# EAGLE design lin_master_node (EAGLE 6.5.0)
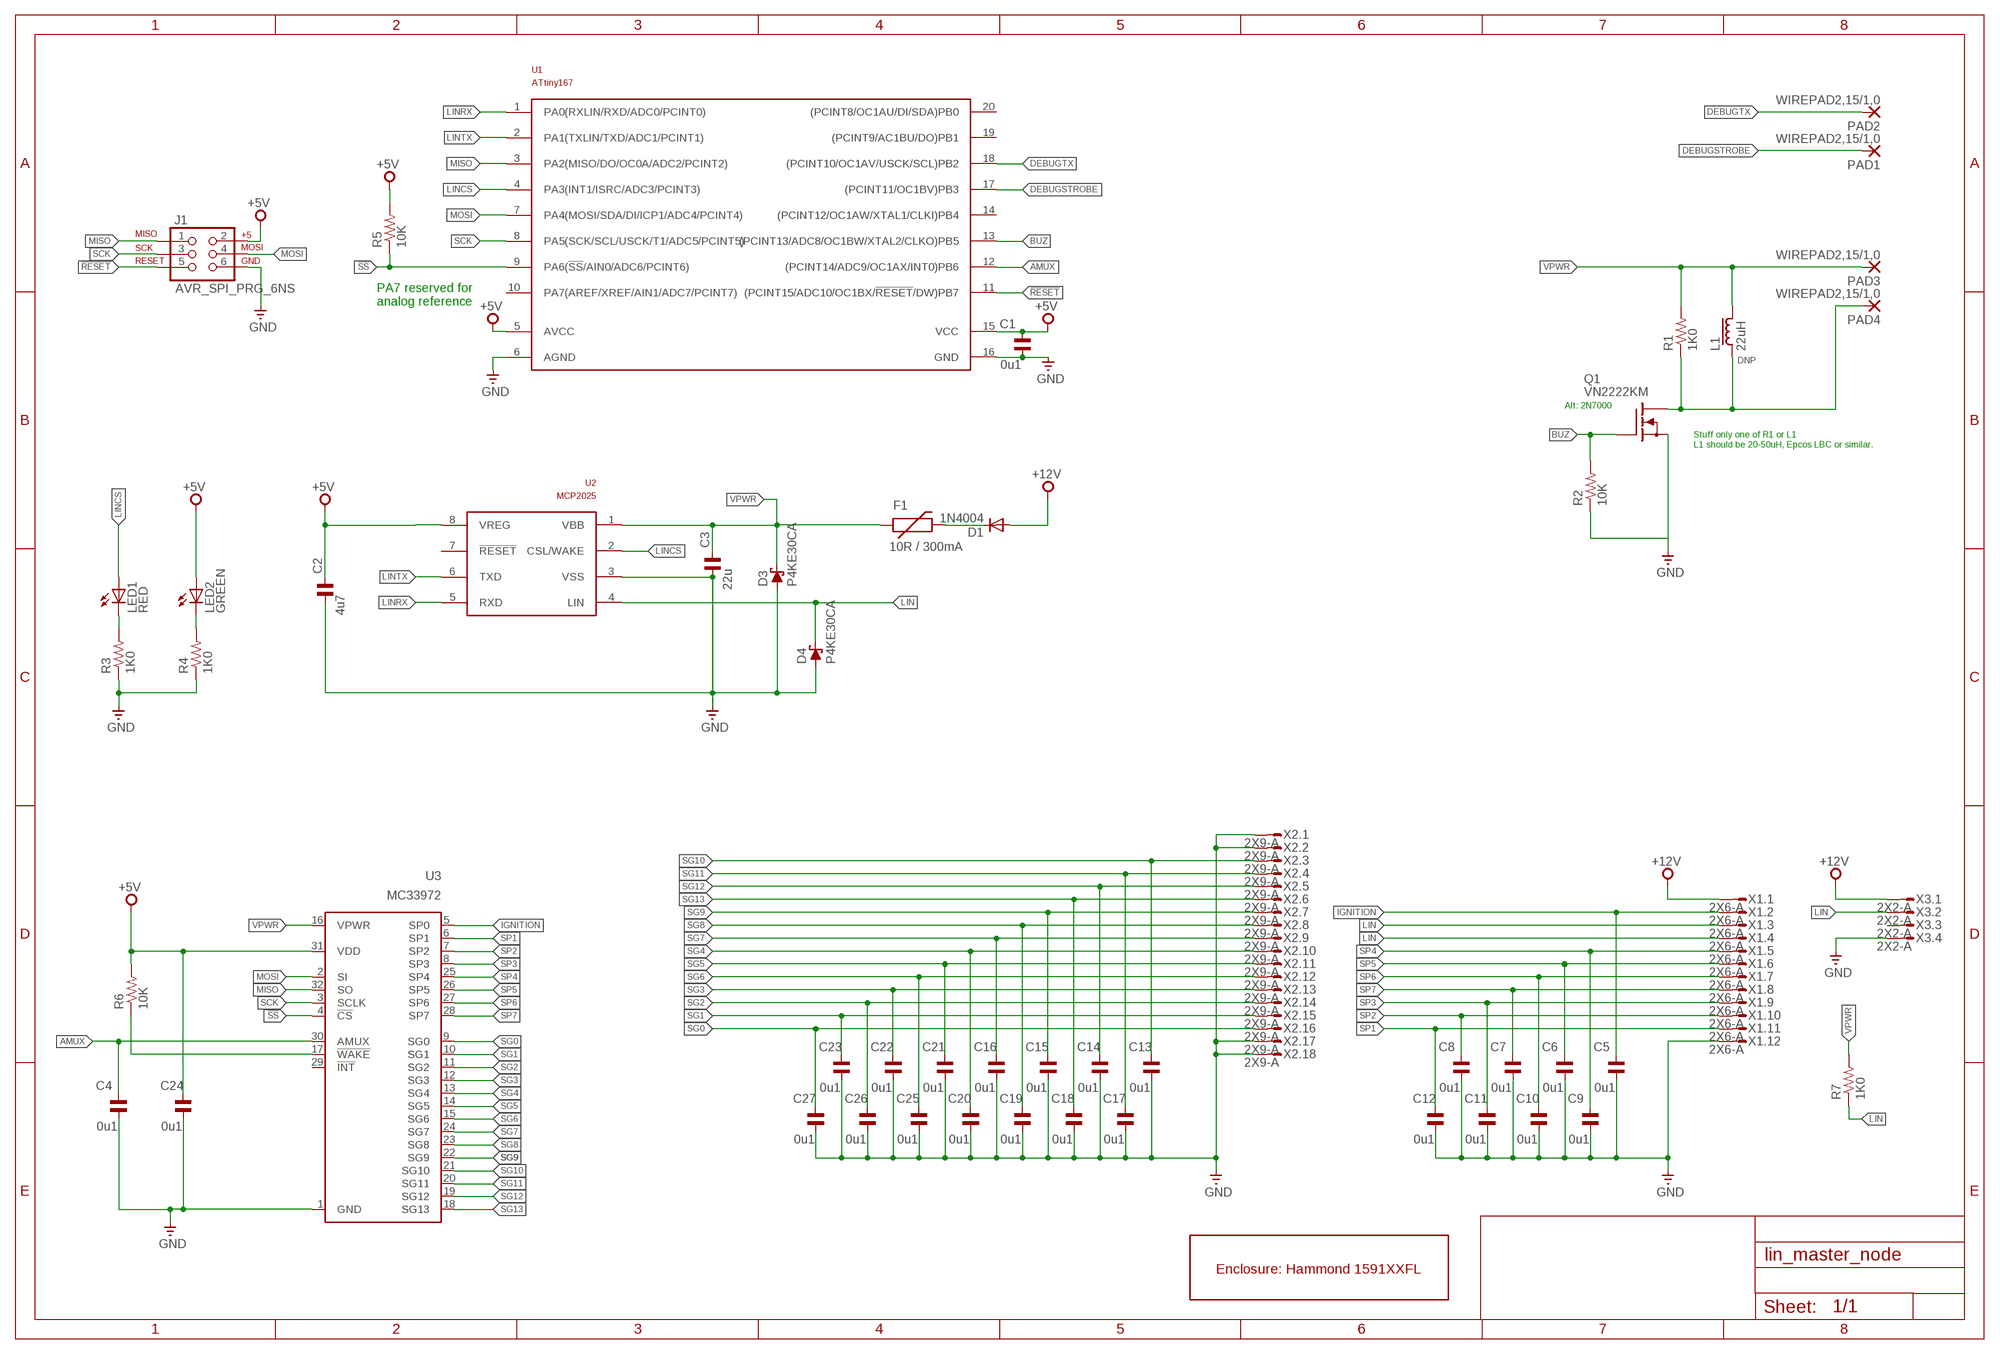
[diagram p0: schematic, sheet 1]

## Parts
C1  0u1  C-EU050-024X044  [C050-024X044]
C2  4u7  C-EU050-024X044  [C050-024X044]
C3  22u  C-EU050-024X044  [C050-024X044]
C4  0u1  C-EU050-024X044  [C050-024X044]
C5  0u1  C-EUC0805K  [C0805K]
C6  0u1  C-EUC0805K  [C0805K]
C7  0u1  C-EUC0805K  [C0805K]
C8  0u1  C-EUC0805K  [C0805K]
C9  0u1  C-EUC0805K  [C0805K]
C10  0u1  C-EUC0805K  [C0805K]
C11  0u1  C-EUC0805K  [C0805K]
C12  0u1  C-EUC0805K  [C0805K]
C13  0u1  C-EUC0805K  [C0805K]
C14  0u1  C-EUC0805K  [C0805K]
C15  0u1  C-EUC0805K  [C0805K]
C16  0u1  C-EUC0805K  [C0805K]
C17  0u1  C-EUC0805K  [C0805K]
C18  0u1  C-EUC0805K  [C0805K]
C19  0u1  C-EUC0805K  [C0805K]
C20  0u1  C-EUC0805K  [C0805K]
C21  0u1  C-EUC0805K  [C0805K]
C22  0u1  C-EUC0805K  [C0805K]
C23  0u1  C-EUC0805K  [C0805K]
C24  0u1  C-EU050-024X044  [C050-024X044]
C25  0u1  C-EUC0805K  [C0805K]
C26  0u1  C-EUC0805K  [C0805K]
C27  0u1  C-EUC0805K  [C0805K]
D1  1N4004  [DO41-10]
D3  P4KE30CA  P4KEXX  [DO41-10]
D4  P4KE30CA  P4KEXX  [DO41-10]
F1  10R / 300mA  PTCPTH  [PTC]
J1  AVR_SPI_PRG_6NS  [2X3-NS]
L1  22uH  LBC15A  [LBC15A]
LED1  RED  LED3MM  [LED3MM]
LED2  GREEN  LED3MM  [LED3MM]
PAD1  WIREPAD2,15/1,0  [2,15/1,0]
PAD2  WIREPAD2,15/1,0  [2,15/1,0]
PAD3  WIREPAD2,15/1,0  [2,15/1,0]
PAD4  WIREPAD2,15/1,0  [2,15/1,0]
Q1  VN2222KM  [TO237]
R1  1K0  R-EU_0207/10  [0207/10]
R2  10K  R-EU_0207/10  [0207/10]
R3  1K0  R-EU_0207/10  [0207/10]
R4  1K0  R-EU_0207/10  [0207/10]
R5  10K  R-EU_0207/10  [0207/10]
R6  10K  R-EU_0207/10  [0207/10]
R7  1K0  R-EU_0207/10  [0207/10]
U1  ATtiny167  ATTINY167  [SO20W]
U2  MCP2025  [SO08]
U3  MC33972  [SOIC32W]
U$1  1591XXAFL  [1591XXAFL]
X1  2X6-A  [4-794618-2]
X2  2X9-A  [4-794618-8]
X3  2X2-A  [3-794618-4]

## Nets
!RESET: J1.5 U1.11((PCINT15/ADC10/OC1BX/!RESET!/DW)PB7)
!SS: R5.1 U1.9(PA6(!SS!/AIN0/ADC6/PCINT6)) U3.4(!CS)
+5V [power]: C1.1 C2.1 C24.1 J1.2 LED2.A R5.2 R6.2 U1.5(AVCC) U1.15(VCC) U2.8(VREG) U3.31(VDD)
+12V [power]: D1.A X1.1 X3.1
AMUX: C4.1 U1.12((PCINT14/ADC9/OC1AX/INT0)PB6) U3.30(AMUX)
BUZ: Q1.2(G) R2.2 U1.13((PCINT13/ADC8/OC1BW/XTAL2/CLKO)PB5)
DEBUGSTROBE: PAD1.1(P) U1.17((PCINT11/OC1BV)PB3)
DEBUGTX: PAD2.1(P) U1.18((PCINT10/OC1AV/USCK/SCL)PB2)
GND [power]: C1.2 C2.2 C3.2 C4.2 C5.2 C6.2 C7.2 C8.2 C9.2 C10.2 C11.2 C12.2 C13.2 C14.2 C15.2 C16.2 C17.2 C18.2 C19.2 C20.2 C21.2 C22.2 C23.2 C24.2 C25.2 C26.2 C27.2 D3.A D4.A J1.6 Q1.3(S) R2.1 R3.1 R4.1 U1.6(AGND) U1.16(GND) U2.3(VSS) U3.1(GND) X1.12 X2.1 X2.2 X2.17 X2.18 X3.4
IGNITION: C5.1 U3.5(SP0) X1.2
LIN: D4.C R7.1 U2.4(LIN) X1.3 X1.4 X3.2
LINCS: LED1.A U1.4(PA3(INT1/ISRC/ADC3/PCINT3)) U2.2(CSL/WAKE)
LINRX: U1.1(PA0(RXLIN/RXD/ADC0/PCINT0)) U2.5(RXD)
LINTX: U1.2(PA1(TXLIN/TXD/ADC1/PCINT1)) U2.6(TXD)
MISO: J1.1 U1.3(PA2(MISO/DO/OC0A/ADC2/PCINT2)) U3.32(SO)
MOSI: J1.4 U1.7(PA4(MOSI/SDA/DI/ICP1/ADC4/PCINT4)) U3.2(SI)
N$1: LED1.K(C) R3.2
N$2: R6.1 U3.17(!WAKE)
N$3: L1.1 PAD4.1(P) Q1.1(D) R1.1
N$4: LED2.K(C) R4.2
N$5 [power]: D1.C F1.P$2
SCK: J1.3 U1.8(PA5(SCK/SCL/USCK/T1/ADC5/PCINT5)) U3.3(SCLK)
SG0: C27.1 U3.9(SG0) X2.16
SG1: C23.1 U3.10(SG1) X2.15
SG2: C26.1 U3.11(SG2) X2.14
SG3: C22.1 U3.12(SG3) X2.13
SG4: C20.1 U3.13(SG4) X2.10
SG5: C21.1 U3.14(SG5) X2.11
SG6: C25.1 U3.15(SG6) X2.12
SG7: C16.1 U3.24(SG7) X2.9
SG8: C19.1 U3.23(SG8) X2.8
SG9: C15.1 U3.22(SG9) X2.7
SG10: C13.1 U3.21(SG10) X2.3
SG11: C17.1 U3.20(SG11) X2.4
SG12: C14.1 U3.19(SG12) X2.5
SG13: C18.1 U3.18(SG13) X2.6
SP1: C12.1 U3.6(SP1) X1.11
SP2: C8.1 U3.7(SP2) X1.10
SP3: C11.1 U3.8(SP3) X1.9
SP4: C9.1 U3.25(SP4) X1.5
SP5: C6.1 U3.26(SP5) X1.6
SP6: C10.1 U3.27(SP6) X1.7
SP7: C7.1 U3.28(SP7) X1.8
VPWR [power]: C3.1 D3.C F1.P$1 L1.2 PAD3.1(P) R1.2 R7.2 U2.1(VBB) U3.16(VPWR)
Unconnected: U1.10(PA7(AREF/XREF/AIN1/ADC7/PCINT7)) U1.14((PCINT12/OC1AW/XTAL1/CLKI)PB4) U1.19((PCINT9/AC1BU/DO)PB1) U1.20((PCINT8/OC1AU/DI/SDA)PB0) U2.7(!RESET) U3.29(!INT) X3.3

## Notes on the sheet
- PA7 reserved for
  analog reference
- Alt: 2N7000
- Stuff only one of R1 or L1
  L1 should be 20-50uH, Epcos LBC or similar.

## Library data of the parts
C1 C4 C24 = custom:C-EU: CAPACITOR, European symbol; PARTNO: FK28X7R1H104K
C2 = custom:C-EU: CAPACITOR, European symbol; PARTNO: FK28X5R0J475K
C3 = custom:C-EU: CAPACITOR, European symbol; PARTNO: FK22X5R1E226M
C5-C23 C25-C27 = custom:C-EU: CAPACITOR, European symbol; PARTNO: C2012X7R1H104K085AA
D1 = custom:1N4004: DIODE general purpose rectifier, 1 A; PARTNO: 1N4004-TP
D3 D4 = custom:P4KEXX: DIODE transient-voltage suppressor; PARTNO: P4KE30CA
F1 = custom:PTC: Resettable Fuse PTC Resettable Fuse. Spark Fun Electronics SKU : COM-08357; PARTNO: CMF-RL10-0
J1 = custom:AVR_SPI_PRG_6: AVR ISP 6 Pin This is the reduced ISP connector for AVR programming. Common on Arduino. This footprint will take up less PCB space and can be used with a 10-pin to 6-pin adapter such as SKU: BOB-08508
L1 = custom:LBC15A: INDUCTOR; DNP: YES
LED1 = custom:LED: LEDs Standard schematic elements and footprints for 5mm, 3mm, 1206, and 0603 sized LEDs. 5mm - Spark Fun Electronics SKU : COM-00529 (and others); PARTNO: C4SMF-RJS-CT0W0BB2
LED2 = custom:LED: LEDs Standard schematic elements and footprints for 5mm, 3mm, 1206, and 0603 sized LEDs. 5mm - Spark Fun Electronics SKU : COM-00529 (and others); PARTNO: C4SMF-GJS-CV0Y0792
PAD1-PAD4 = custom:WIREPAD: Wire PAD connect wire on PCB
Q1 = custom:VN2222KM: N-Channel Enhancement MOSFET (VMOS); 60V; 0,5A; 7,5Ohm
R1 R3 R4 R7 = custom:R-EU_: RESISTOR, European symbol; PARTNO: CF14JT1K00
R2 R5 R6 = custom:R-EU_: RESISTOR, European symbol; PARTNO: CF14JT10K0
U1 = custom:ATTINY167; PARTNO: ATTINY167-SU
U2 = custom:MCP2025: LIN Transceiver with Voltage Regulator; PARTNO: MCP2025-500E/SN
U3 = custom:MC33972: edit this description Auto generated by make-symbol-device-package-bsdl.ulp Rev. 43 Source:; PARTNO: MC33972ATEW
U$1 = custom:1591XXAFL; PARTNO: 1591XXAFLBK
X1 = custom:2X6; PARTNO: 4-794618-2
X2 = custom:2X9; PARTNO: 4-794618-8
X3 = custom:2X2; PARTNO: 3-794618-4

## Net classes
0 default: width 0.381 mm
1 power: width 0.635 mm

## Board
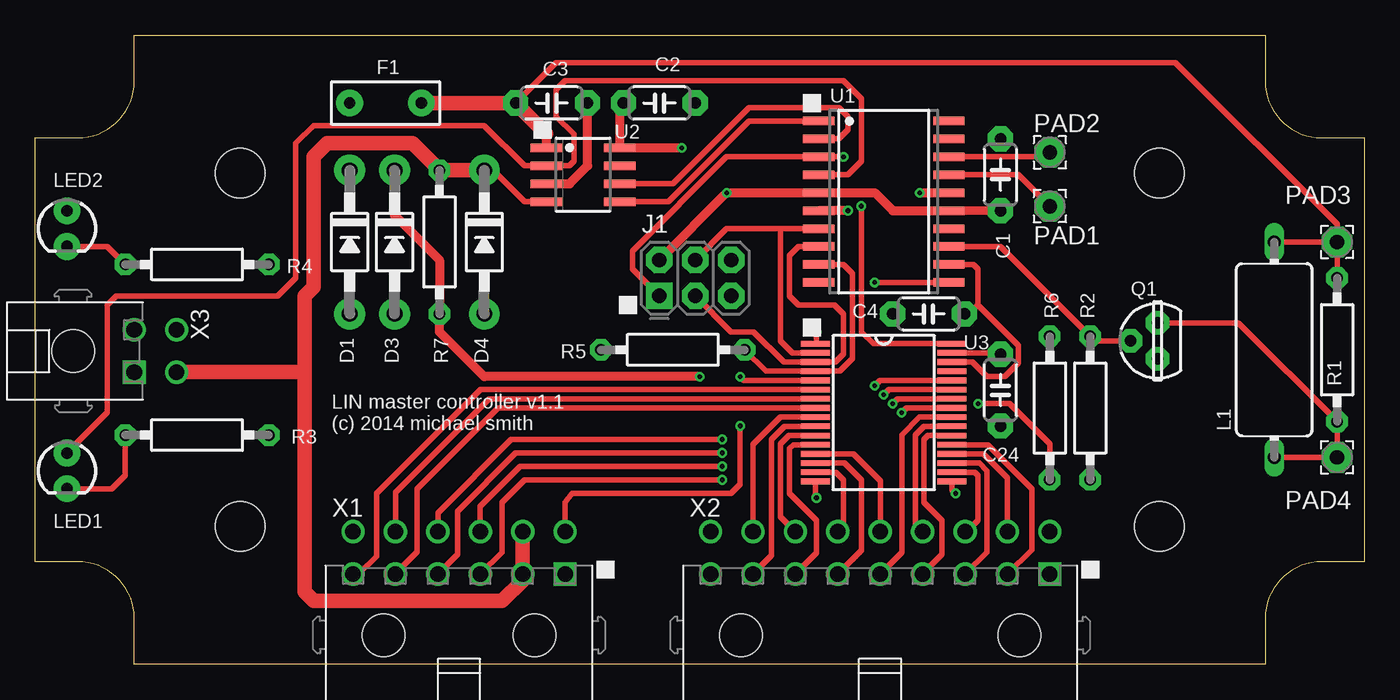
[diagram p1: board, top side]
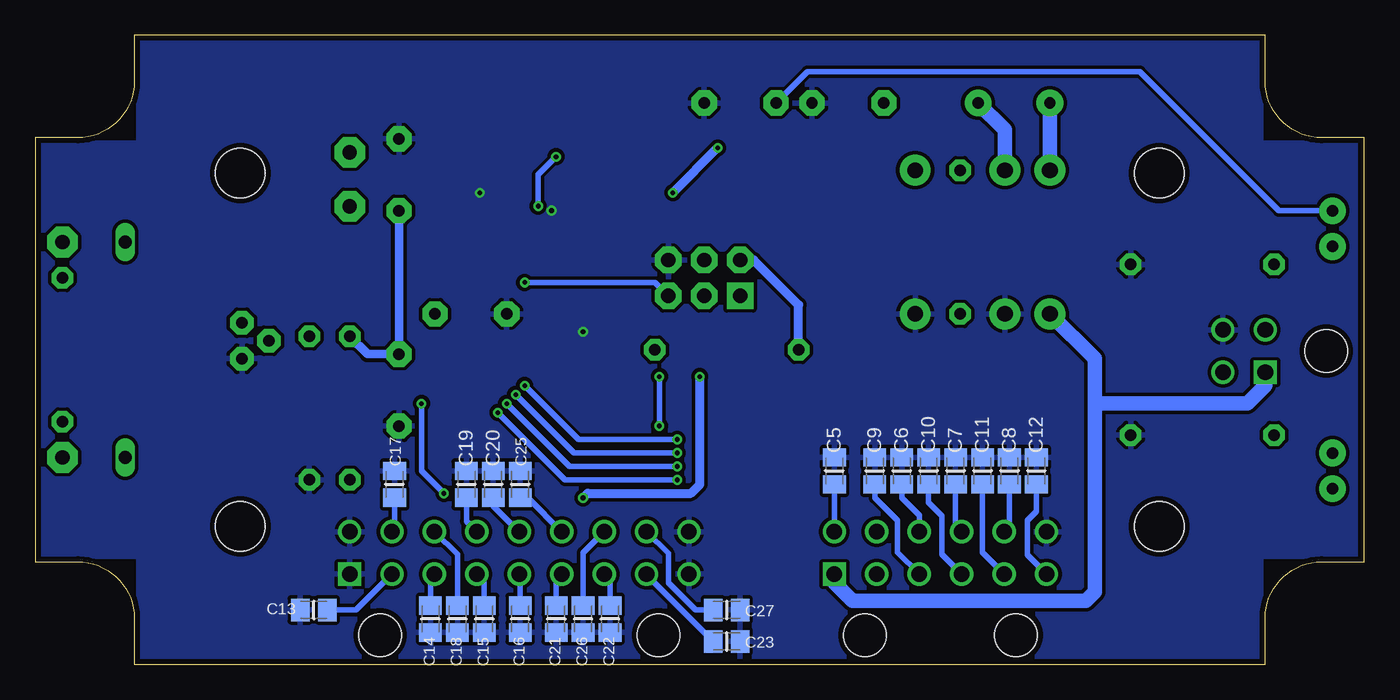
[diagram p2: board, bottom side, seen from below]

Size 94 x 44.5 mm. Coordinates in mm from the lower left corner, seen from the top.
Copper layers (1*16): Top 0.0356mm / dielectric 1.5011mm / Bottom 0.0356mm
Design rules "LaenPCBOrder": minimum track width 6mil, minimum drill 13mil, track to track 6mil, track to pad 6mil, pad to pad 6mil, via to via 6mil, smd to smd 6mil, copper to edge 15mil, drill to drill 6mil, minimum pad ring 7mil, minimum via ring 7mil, stop-mask expansion 3mil, vias tented up to drill 0mil, thermal gap 10mil

### Footprints (pad centres in the part's own frame; a part is rotated, then mirrored left to right if it is on the bottom)
C050-024X044 = drill 0.813 pad 1.778 octagon: 1 -2.54,0; 2 2.54,0
C0805K = smd 1.3 x 1.6: 1 -0.953,0; 2 0.953,0
DO41-10 = drill 1.118 pad 2.184: A 5.08,0; C -5.08,0
PTC = drill 0.8 pad 1.88: P$1 -2.54,0; P$2 2.54,0
2X3-NS = drill 1.016 pad 1.88 square: 1 -2.54,-1.27 | drill 1.016 pad 1.88 octagon: 2 -2.54,1.27; 3 0,-1.27; 4 0,1.27; 5 2.54,-1.27; 6 2.54,1.27
LBC15A = drill 0.914 long: 1 -7.62,0; 2 7.62,0
LED3MM = drill 0.813 pad 1.88: A -1.27,0; K 1.27,0
2,15/1,0 = drill 1.016 pad 2.159 octagon: 1 0,0
TO237 = drill 0.813 pad 1.676 octagon: 1 1.27,0; 2 0,1.905; 3 -1.27,0
0207/10 = drill 0.813 pad 1.524 octagon: 1 -5.08,0; 2 5.08,0
SO20W = smd 0.6 x 2.2: 1 -5.715,-4.6; 2 -4.445,-4.6; 3 -3.175,-4.6; 4 -1.905,-4.6; 5 -0.635,-4.6; 6 0.635,-4.6; 7 1.905,-4.6; 8 3.175,-4.6; 9 4.445,-4.6; 10 5.715,-4.6; 11 5.715,4.6; 12 4.445,4.6; 13 3.175,4.6; 14 1.905,4.6; 15 0.635,4.6; 16 -0.635,4.6; 17 -1.905,4.6; 18 -3.175,4.6; 19 -4.445,4.6; 20 -5.715,4.6
SO08 = smd 0.6 x 2.2: 1 -1.905,-2.6; 2 -0.635,-2.6; 3 0.635,-2.6; 4 1.905,-2.6; 5 1.905,2.6; 6 0.635,2.6; 7 -0.635,2.6; 8 -1.905,2.6
SOIC32W = smd 2.05 x 0.4: 1 -4.825,4.875; 2 -4.825,4.225; 3 -4.825,3.575; 4 -4.825,2.925; 5 -4.825,2.275; 6 -4.825,1.625; 7 -4.825,0.975; 8 -4.825,0.325; 9 -4.825,-0.325; 10 -4.825,-0.975; 11 -4.825,-1.625; 12 -4.825,-2.275; 13 -4.825,-2.925; 14 -4.825,-3.575; 15 -4.825,-4.225; 16 -4.825,-4.875; 17 4.825,-4.875; 18 4.825,-4.225; 19 4.825,-3.575; 20 4.825,-2.925; 21 4.825,-2.275; 22 4.825,-1.625; 23 4.825,-0.975; 24 4.825,-0.325; 25 4.825,0.325; 26 4.825,0.975; 27 4.825,1.625; 28 4.825,2.275; 29 4.825,2.925; 30 4.825,3.575; 31 4.825,4.225; 32 4.825,4.875
1591XXAFL = hole 3.5: -32.5,12.5; 32.5,12.5; -32.5,-12.5; 32.5,-12.5
4-794618-2 = drill 1.1 square: 1 0,0 | drill 1.1: 2 0,3; 3 -3,0; 4 -3,3; 5 -6,0; 6 -6,3; 7 -9,0; 8 -9,3; 9 -12,0; 10 -12,3; 11 -15,0; 12 -15,3 | hole 3: -2.15,-4.32; -12.85,-4.32
4-794618-8 = drill 1.1 square: 1 0,0 | drill 1.1: 2 0,3; 3 -3,0; 4 -3,3; 5 -6,0; 6 -6,3; 7 -9,0; 8 -9,3; 9 -12,0; 10 -12,3; 11 -15,0; 12 -15,3; 13 -18,0; 14 -18,3; 15 -21,0; 16 -21,3; 17 -24,0; 18 -24,3 | hole 3: -2.15,-4.32; -21.85,-4.32
3-794618-4 = drill 1.1 square: 1 0,0 | drill 1.1: 2 0,3; 3 -3,0; 4 -3,3 | hole 3: -1.5,-4.32

### Placement (x,y rotation side)
C1  68.27,34.63 90 top
C2  44.14,39.71 0 top
C3  36.52,39.71 0 top
C4  63.19,24.79 180 top
C5  37.48,13.68 90 bottom
C6  32.71,13.68 90 bottom
C7  28.9,13.68 90 bottom
C8  25.09,13.68 90 bottom
C9  34.62,13.68 90 bottom
C10  30.81,13.68 90 bottom
C11  27,13.68 90 bottom
C12  23.19,13.68 90 bottom
C13  74.31,3.84 180 bottom
C14  66.05,3.2 270 bottom
C15  62.24,3.2 270 bottom
C16  59.7,3.2 270 bottom
C17  68.59,12.73 90 bottom
C18  64.15,3.2 270 bottom
C19  63.51,12.73 90 bottom
C20  61.6,12.73 90 bottom
C21  57.16,3.2 270 bottom
C22  53.35,3.2 270 bottom
C23  45.09,1.61 0 bottom
C24  68.27,19.39 270 top
C25  59.7,12.73 90 bottom
C26  55.25,3.2 270 bottom
C27  45.09,3.84 0 bottom
D1  22.23,29.87 270 top
D3  25.41,29.87 270 top
D4  31.76,29.87 270 top
F1  24.77,39.71 180 top
J1  46.68,27.33 0 top
L1  87.64,22.25 90 top
LED1  2.23,13.68 270 top
LED2  2.23,30.82 270 top
PAD1  71.76,32.41 0 top
PAD2  71.76,36.22 0 top
PAD3  92.09,29.87 0 top
PAD4  92.09,14.63 0 top
Q1  79.38,22.89 90 top
R1  92.09,22.25 90 top
R2  74.62,18.12 90 top
R3  11.44,16.22 180 top
R4  11.44,28.28 180 top
R5  45.09,22.25 180 top
R6  71.76,18.12 90 top
R7  28.58,29.87 270 top
U1  60.02,32.73 270 top
U2  38.74,34.63 270 top
U3  60.02,17.8 0 top
U$1  47,22.25 0 top
X1  37.48,6.38 0 top
X2  71.76,6.38 0 top
X3  6.99,20.66 270 top

### Tracks (layer width: path | path; a pad name or v marks a point on that pad's centre or on a via)
!RESET  (via drill 0.33)
  Top 0.381: U1.11 v59.38,27.01
  Bottom 0.381: v59.38,27.01 50.17,27.01 J1.5
!SS
  Top 0.381: R5.1 51.7,20.73 U3.4 56.91,20.73 57.79,21.62 57.79,27.65 57.16,28.28 U1.9
+5V  (via drill 0.33)
  Top 0.381: U3.31 68.18,22.03 C24.1
  Top 0.61: U1.15 C1.1
  Top 0.635: C2.1 41.34,39.45 U2.8 v45.73,36.54 | J1.2 v48.91,33.36 U1.5 59.38,33.36 60.65,32.09 U1.15
  Bottom 0.381: C2.1 39.38,41.94 15.88,41.94 6.04,32.09 LED2.A
  Bottom 0.61: C1.1 C24.1 70.5,21.93 R6.2
  Bottom 0.635: R5.2 40.02,25.43 43.19,28.6 J1.2 | v45.73,36.54 v48.91,33.36
+12V
  Bottom 1.016: X1.1 37.48,5.74 36.2,4.47 19.69,4.47 19.06,5.11 19.06,18.44 | 19.06,18.44 19.06,21.62 D1.A | X3.1 6.99,19.71 8.26,18.44 19.06,18.44
AMUX
  Top 0.381: U3.30 66.28,21.38 67.32,20.34 68.59,20.34 69.54,21.3 69.54,22.57 66.69,25.43 | U1.12 66.37,28.28 66.69,27.96 66.69,25.43 | C4.1 66.05,24.79 66.69,25.43
BUZ
  Top 0.381: U1.13 68.27,29.55 R2.2 74.94,22.89 Q1.2
DEBUGSTROBE
  Top 0.381: U1.17 69.54,34.63 PAD1.1
DEBUGTX
  Top 0.381: U1.18 71.45,35.9 PAD2.1
GND  (via drill 0.33)
  Top 0.381: U3.1 55.25,22.74 v55.25,23.52
  Top 0.635: v62.56,33.36 U1.16 | v57.48,32.09 U1.6 | U2.3 37.79,34 39.06,35.27 C3.2
  pour Bottom (isolate 0.254): 0.64,7.65 0.64,36.86 7.31,36.86 7.31,44.16 86.69,44.16 86.69,36.86 93.67,36.86 93.67,7.65 86.69,7.65 86.69,0.34 7.31,0.34 7.31,7.65
IGNITION  (via drill 0.33)
  Top 0.381: v49.86,16.85 49.86,12.73 49.22,12.09 37.97,12.09 37.48,11.46 X1.2 | v49.86,20.34 50.12,20.08 U3.5
  Bottom 0.381: C5.1 X1.2 | v49.86,16.85 v49.86,20.34
LIN
  Top 0.381: D4.C 32.39,34.95 34.62,32.73 U2.4
  Top 1.016: 19.06,20.66 19.06,26.06 19.69,26.7 19.69,35.9 20.65,36.86 26.68,36.86 R7.1 D4.C | 19.06,20.66 19.06,5.11 19.69,4.47 33.03,4.47 34.48,5.92 X1.3 X1.4 | X3.2 19.06,20.66
LINCS
  Top 0.381: LED1.A 5.09,17.8 5.09,25.43 5.72,26.06 17.15,26.06 18.42,27.33 18.42,36.86 19.69,38.12 31.76,38.12 34.62,35.27 U2.2 37.79,35.27 38.11,35.59 38.11,37.49 36.84,38.76 36.84,40.66 37.48,41.3 57.16,41.3 58.43,40.03 58.43,35.59 57.48,34.63 U1.4
LINRX
  Top 0.381: U2.5 44.78,32.73 50.49,38.44 U1.1
LINTX
  Top 0.381: U2.6 45.09,34 50.49,39.4 56.84,39.4 57.48,38.76 57.48,37.81 56.84,37.17 U1.2
MISO  (via drill 0.33)
  Top 0.381: J1.1 42.24,27.96 42.24,29.23 48.91,35.9 U1.3 v57.16,35.9 | U3.32 59.27,22.68 58.43,23.52 v58.43,32.41
  Bottom 0.381: v58.43,32.41 58.43,34.63 v57.16,35.9
MOSI
  Top 0.381: J1.4 48.91,30.82 52.71,30.82 | 52.71,30.82 U1.7 | U3.2 53.57,22.03 52.71,22.89 52.71,30.82
N$1
  Top 0.381: LED1.K 5.41,12.41 6.36,13.36 R3.2
N$2  (via drill 0.33)
  Top 0.381: U3.17 64.84,12.35 v65.1,12.09
  Top 0.406: v66.69,18.44 68.91,18.44 71.76,15.58 R6.1
  Bottom 0.406: v65.1,12.09 66.69,13.68 v66.69,18.44
N$3
  Top 0.381: Q1.1 85.1,24.16 R1.1 PAD4.1 L1.1
N$4
  Top 0.381: LED2.K 5.09,29.55 R4.2
N$5
  Bottom 1.016: D1.C F1.P$2
SCK
  Top 0.381: U1.8 53.98,29.55 53.35,28.92 53.35,26.06 53.98,25.43 56.52,25.43 57.16,24.79 57.16,21.93 56.61,21.38 U3.3 52.95,21.38 50.81,23.52 49.22,23.52 J1.3
SG0
  Top 0.381: X2.16 50.77,15.54 52.71,17.48 U3.9
  Bottom 0.406: X2.16 49.22,7.83 49.22,5.74 47.32,3.84 C27.1
SG1
  Top 0.381: X2.15 52.08,7.69 52.08,15.9 53.01,16.83 U3.10
  Bottom 0.406: C23.1 50.77,6.33 X2.15
SG2
  Top 0.381: X2.14 52.71,10.43 52.71,15.58 53.31,16.18 U3.11
  Bottom 0.406: X2.14 55.25,7.88 C26.1
SG3
  Top 0.381: U3.12 53.61,15.53 53.35,15.27 53.35,12.09 55.25,10.19 55.25,7.87 X2.13
  Bottom 0.406: X2.13 53.35,5.96 C22.1
SG4
  Top 0.381: X2.10 59.77,12.98 57.86,14.88 U3.13
  Bottom 0.406: C20.1 61.6,11.21 X2.10
SG5
  Top 0.381: X2.11 58.43,8.04 58.43,13.04 57.24,14.23 U3.14
  Bottom 0.406: X2.11 57.16,5.98 C21.1
SG6
  Top 0.381: X2.12 56.77,9.47 57.16,9.87 57.16,13.04 56.62,13.58 U3.15
  Bottom 0.406: C25.1 59.16,11.77 X2.12
SG7
  Top 0.381: X2.9 61.29,7.9 61.29,16.22 62.55,17.48 U3.24
  Bottom 0.406: X2.9 59.7,6.31 C16.1
SG8
  Top 0.381: X2.8 62.77,9.34 62.24,9.87 62.24,16.22 62.85,16.83 U3.23
  Bottom 0.406: C19.1 63.51,10.12 X2.8
SG9
  Top 0.381: X2.7 64.15,7.76 64.15,10.19 62.88,11.46 62.88,15.9 63.16,16.18 U3.22
  Bottom 0.406: X2.7 62.24,5.85 C15.1
SG10
  Top 0.381: X2.3 70.5,8.11 70.5,12.41 67.37,15.53 U3.21
  Bottom 0.406: C13.1 71.31,3.84 X2.3
SG11
  Top 0.381: X2.4 68.76,13.19 67.07,14.88 U3.20
  Bottom 0.406: C17.1 68.59,9.55 X2.4
SG12
  Top 0.381: X2.5 67.32,7.93 67.32,13.68 66.77,14.23 U3.19
  Bottom 0.406: X2.5 66.05,6.09 C14.1
SG13
  Top 0.381: 66.69,10.19 66.69,13.36 66.47,13.58 U3.18
  Top 0.406: 66.69,10.19 65.88,9.38 X2.6
  Bottom 0.406: X2.6 64.15,7.76 C18.1
SP1
  Top 0.381: X1.11 22.87,6.38 24.14,7.65 24.14,12.09 31.48,19.43 U3.6
  Bottom 0.381: C12.1 23.19,10.82 23.82,10.19 23.82,7.72 X1.11
SP2
  Top 0.381: X1.10 25.47,12.16 32.1,18.78 U3.7
  Bottom 0.381: C8.1 25.09,9.76 X1.10
SP3
  Top 0.381: X1.9 25.47,6.44 27,7.96 27,12.41 32.72,18.13 U3.8
  Bottom 0.381: C11.1 27,7.9 X1.9
SP4  (via drill 0.33)
  Top 0.381: X1.5 33.03,7.93 33.03,11.46 34.62,13.04 v48.59,13.04 | U3.25 61.61,18.13 v61.29,17.8
  Bottom 0.381: v48.59,13.04 56.52,13.04 v61.29,17.8 | 31.47,6.41 X1.5 33.03,7.93 33.03,10.19 34.62,11.77 C9.1
SP5  (via drill 0.33)
  Top 0.381: X1.6 31.47,11.17 34.3,14 v48.59,14 | U3.26 60.99,18.78 v60.65,18.44
  Bottom 0.381: v48.59,14 56.21,14 v60.65,18.44 | C6.1 32.71,11.77 31.47,10.54 X1.6
SP6  (via drill 0.33)
  Top 0.381: X1.7 29.85,7.76 29.85,10.82 33.98,14.95 v48.59,14.95 | U3.27 60.37,19.43 v60.02,19.07
  Bottom 0.381: v48.59,14.95 55.89,14.95 v60.02,19.07 | C10.1 30.81,11.46 29.85,10.5 29.85,7.76 X1.7
SP7  (via drill 0.33)
  Top 0.381: X1.8 28.47,10.71 33.66,15.9 v48.59,15.9 | U3.28 59.75,20.08 v59.38,19.71
  Bottom 0.381: v48.59,15.9 55.57,15.9 v59.38,19.71 | C7.1 28.9,9.8 X1.8
VPWR  (via drill 0.33)
  Top 0.381: U3.16 55.19,11.84 | C3.1 36.84,42.57 80.66,42.57 92.09,31.14 PAD3.1 | PAD3.1 R1.2 | L1.2 PAD3.1
  Top 0.635: 36.14,37.55 U2.1 | 55.19,11.84 v55.25,11.77 | D3.C 25.41,31.77 28.58,28.6 R7.2 28.58,23.52 31.76,20.34 v47,20.34
  Top 1.016: 36.14,37.55 C3.1 F1.P$1
  Bottom 0.635: v55.25,11.77 54.94,12.09 47.63,12.09 47,12.73 v47,20.34
  Bottom 1.016: D3.C 25.41,37.81 F1.P$1

### Text on the board
tPlace: LIN master controller v1.1 / (c) 2014 michael smith